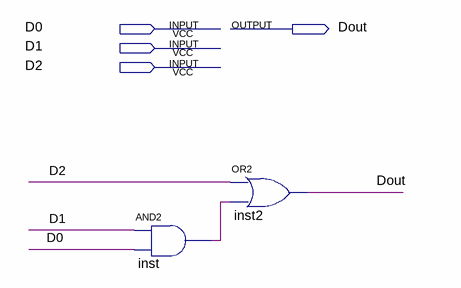
[diagram p0: schematic sheet]
// Quartus schematic D-Logic.bdf as structural Verilog: 2 symbols, 4 pins
module \D-Logic  (
  input  D0,
  input  D1,
  input  D2,
  output Dout
);

  wire inst_out;

  and inst (inst_out, D1, D0);
  or inst2 (Dout, D2, inst_out);
endmodule
